# EAGLE schematic driver (EAGLE 8.7.0)
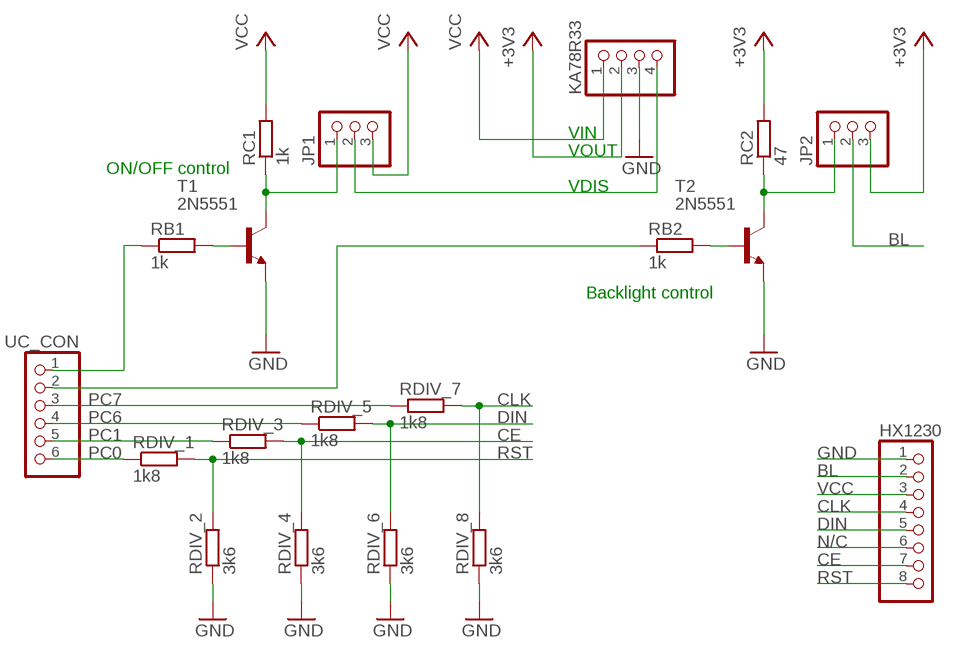
[diagram p0: schematic, sheet 1]

## Parts
HX1230  PINHD-1X8  [1X08]
JP1  PINHD-1X3  [1X03]
JP2  PINHD-1X3  [1X03]
KA78R33  PINHD-1X4  [1X04]
RB1  1k  R-EU_0207/10  [0207/10]
RB2  1k  R-EU_0207/10  [0207/10]
RC1  1k  R-EU_0207/10  [0207/10]
RC2  47  R-EU_0207/10  [0207/10]
RDIV_1  1k8  R-EU_0207/10  [0207/10]
RDIV_2  3k6  R-EU_0207/10  [0207/10]
RDIV_3  1k8  R-EU_0207/10  [0207/10]
RDIV_4  3k6  R-EU_0207/10  [0207/10]
RDIV_5  1k8  R-EU_0207/10  [0207/10]
RDIV_6  3k6  R-EU_0207/10  [0207/10]
RDIV_7  1k8  R-EU_0207/10  [0207/10]
RDIV_8  3k6  R-EU_0207/10  [0207/10]
T1  2N5551  2N5551-NPN-TO92-EBC  [TO92-EBC]
T2  2N5551  2N5551-NPN-TO92-EBC  [TO92-EBC]
UC_CON  PINHD-1X6  [1X06]

## Nets
+3V3: JP2.3 KA78R33.2 RC2.2
BL: HX1230.2 JP2.2
CE: HX1230.7 RDIV_3.2 RDIV_4.2
CLK: HX1230.4 RDIV_7.2 RDIV_8.2
DIN: HX1230.5 RDIV_5.2 RDIV_6.2
GND: HX1230.1 KA78R33.3 RDIV_2.1 RDIV_4.1 RDIV_6.1 RDIV_8.1 T1.E T2.E
N$1: RB1.2 T1.B
N$2: RB2.1 UC_CON.2
N$3: RB1.1 UC_CON.1
N$4: JP1.2 KA78R33.4
N$5: JP1.1 RC1.1 T1.C
N$7: RB2.2 T2.B
N$8: JP2.1 RC2.1 T2.C
N/C: HX1230.6
PC0: RDIV_1.1 UC_CON.6
PC1: RDIV_3.1 UC_CON.5
PC6: RDIV_5.1 UC_CON.4
PC7: RDIV_7.1 UC_CON.3
RST: HX1230.8 RDIV_1.2 RDIV_2.2
VCC: HX1230.3 JP1.3 KA78R33.1 RC1.2

## Notes on the sheet
- VIN
- VOUT
- ON/OFF control
- VDIS
- Backlight control

## Library data of the parts
HX1230 = pinhead:PINHD-1X8: PIN HEADER
JP1 JP2 = pinhead:PINHD-1X3: PIN HEADER
KA78R33 = pinhead:PINHD-1X4: PIN HEADER
RB1 RB2 RC1 RC2 RDIV_1-RDIV_8 = resistor:R-EU_: RESISTOR, European symbol
T1 T2 = transistor-neu-to92:*-NPN-: NPN Transistror
UC_CON = pinhead:PINHD-1X6: PIN HEADER